# EAGLE schematic TrinTheremin (EAGLE 8.2.0)
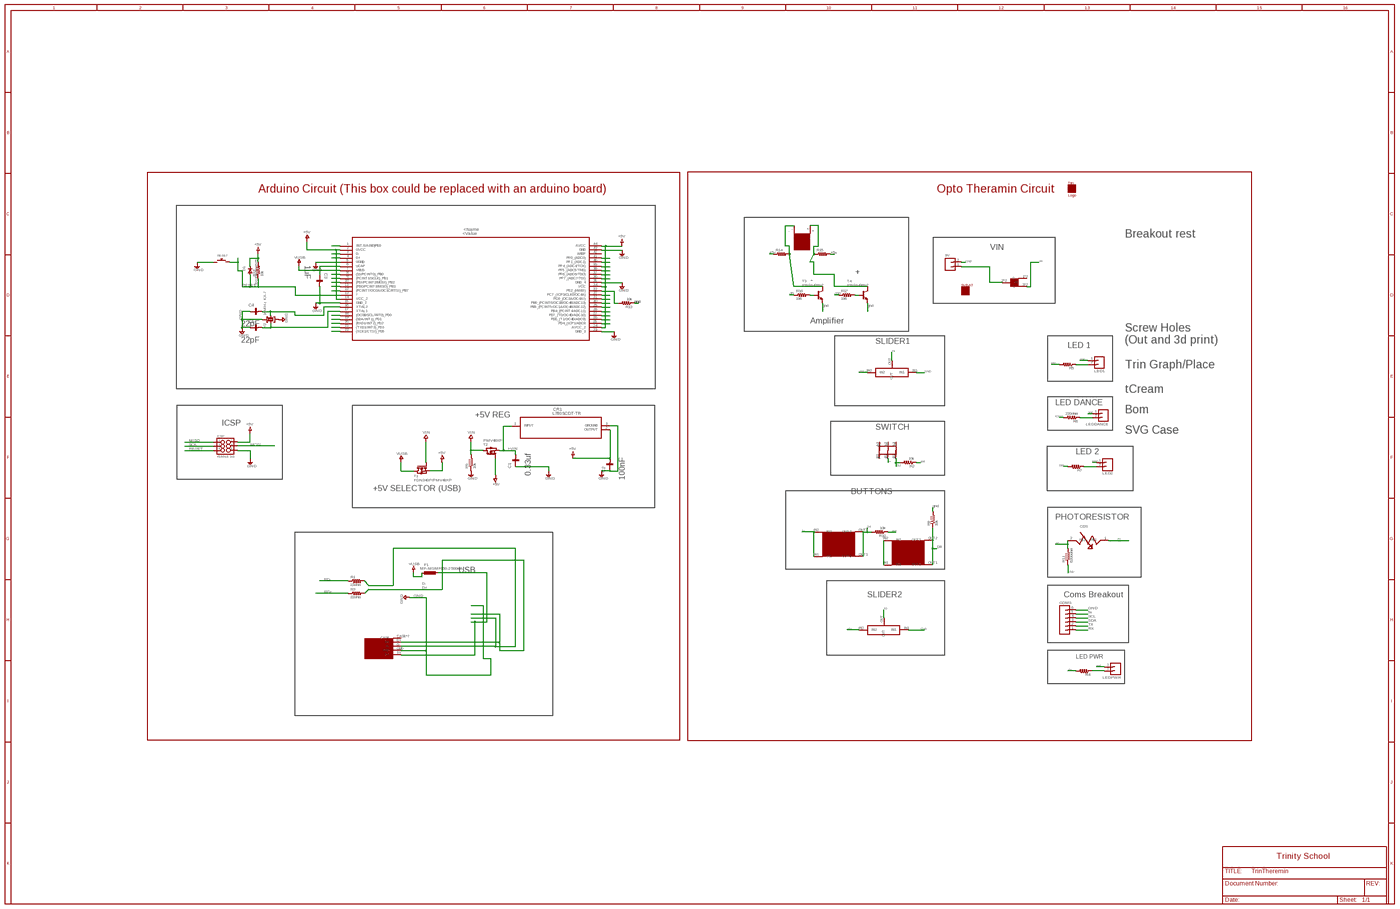
[diagram p0: schematic, sheet 1, overview]
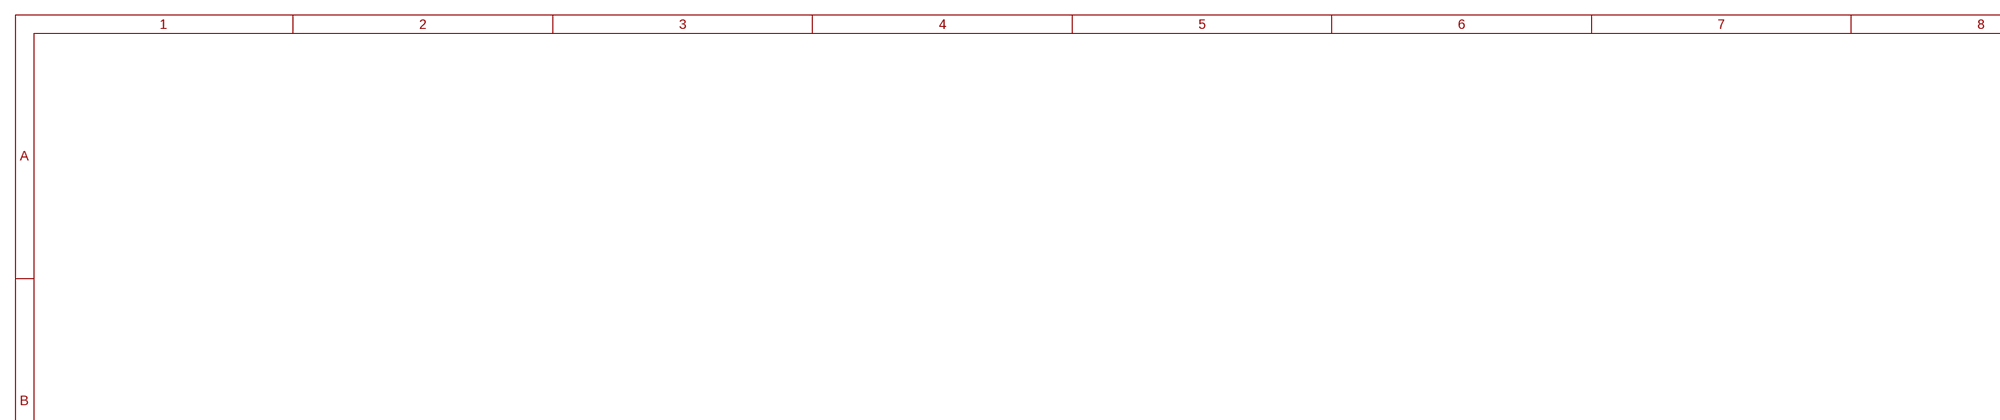
[diagram p1: schematic, sheet 1, part 1 of 4]
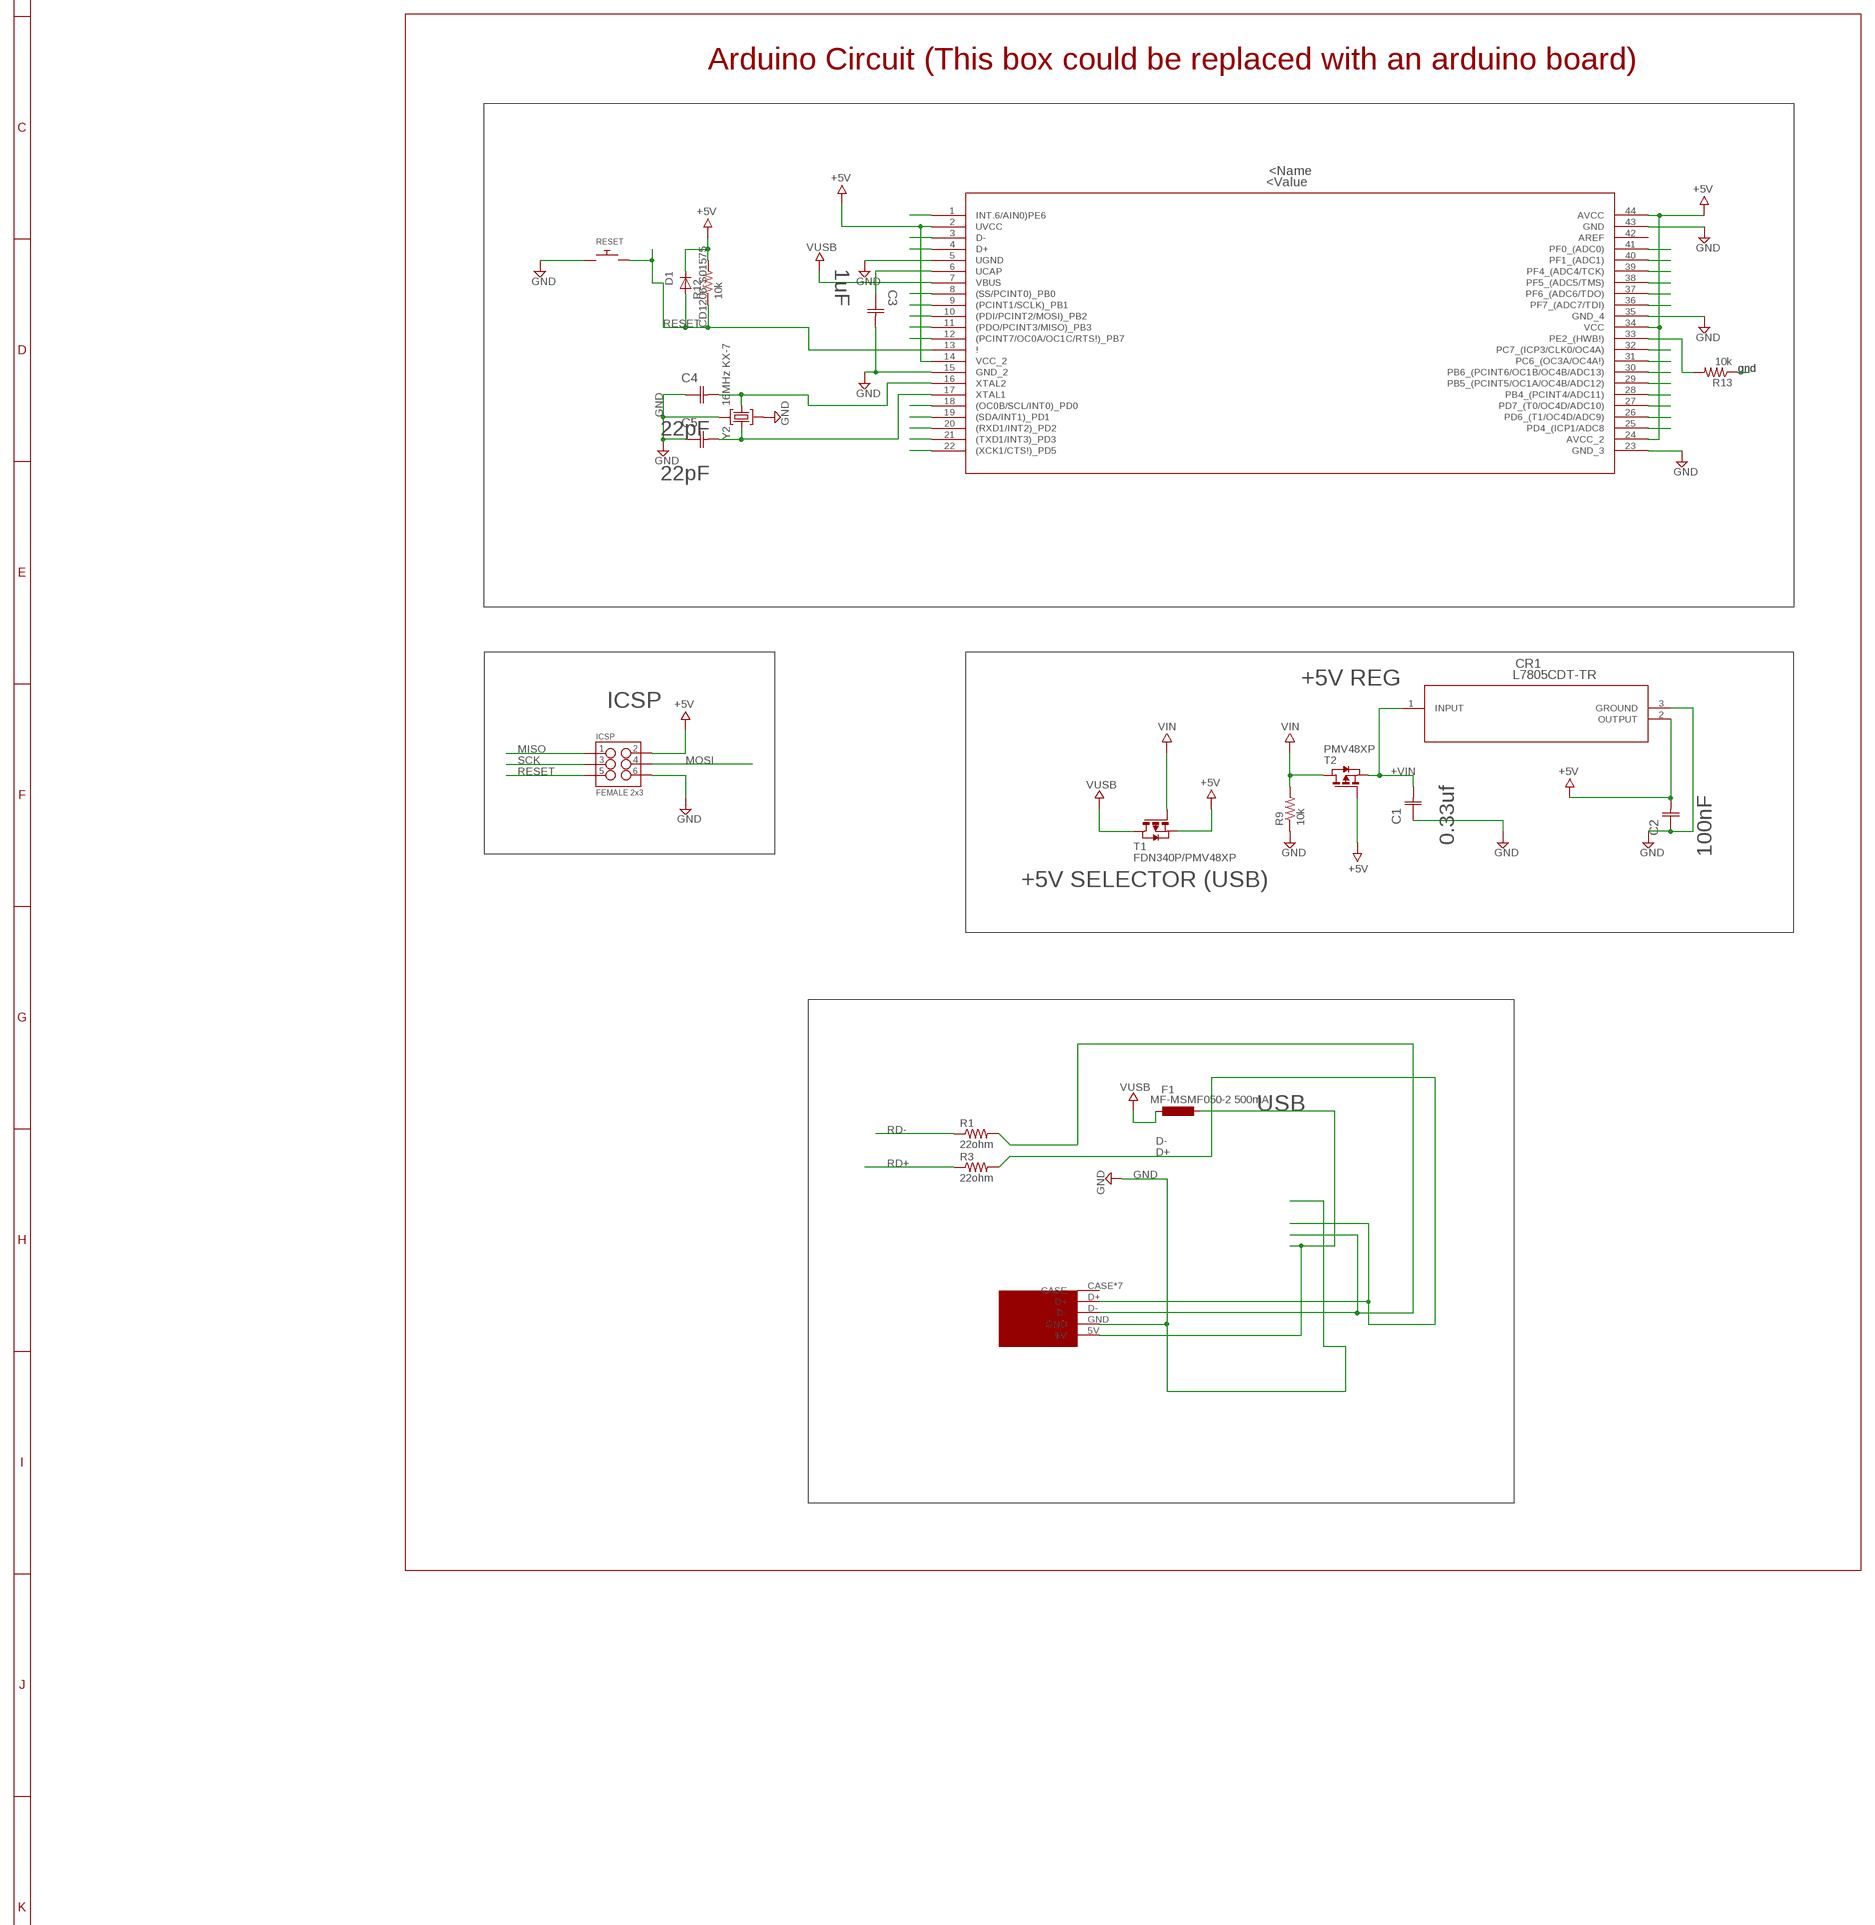
[diagram p2: schematic, sheet 1, part 2 of 4]
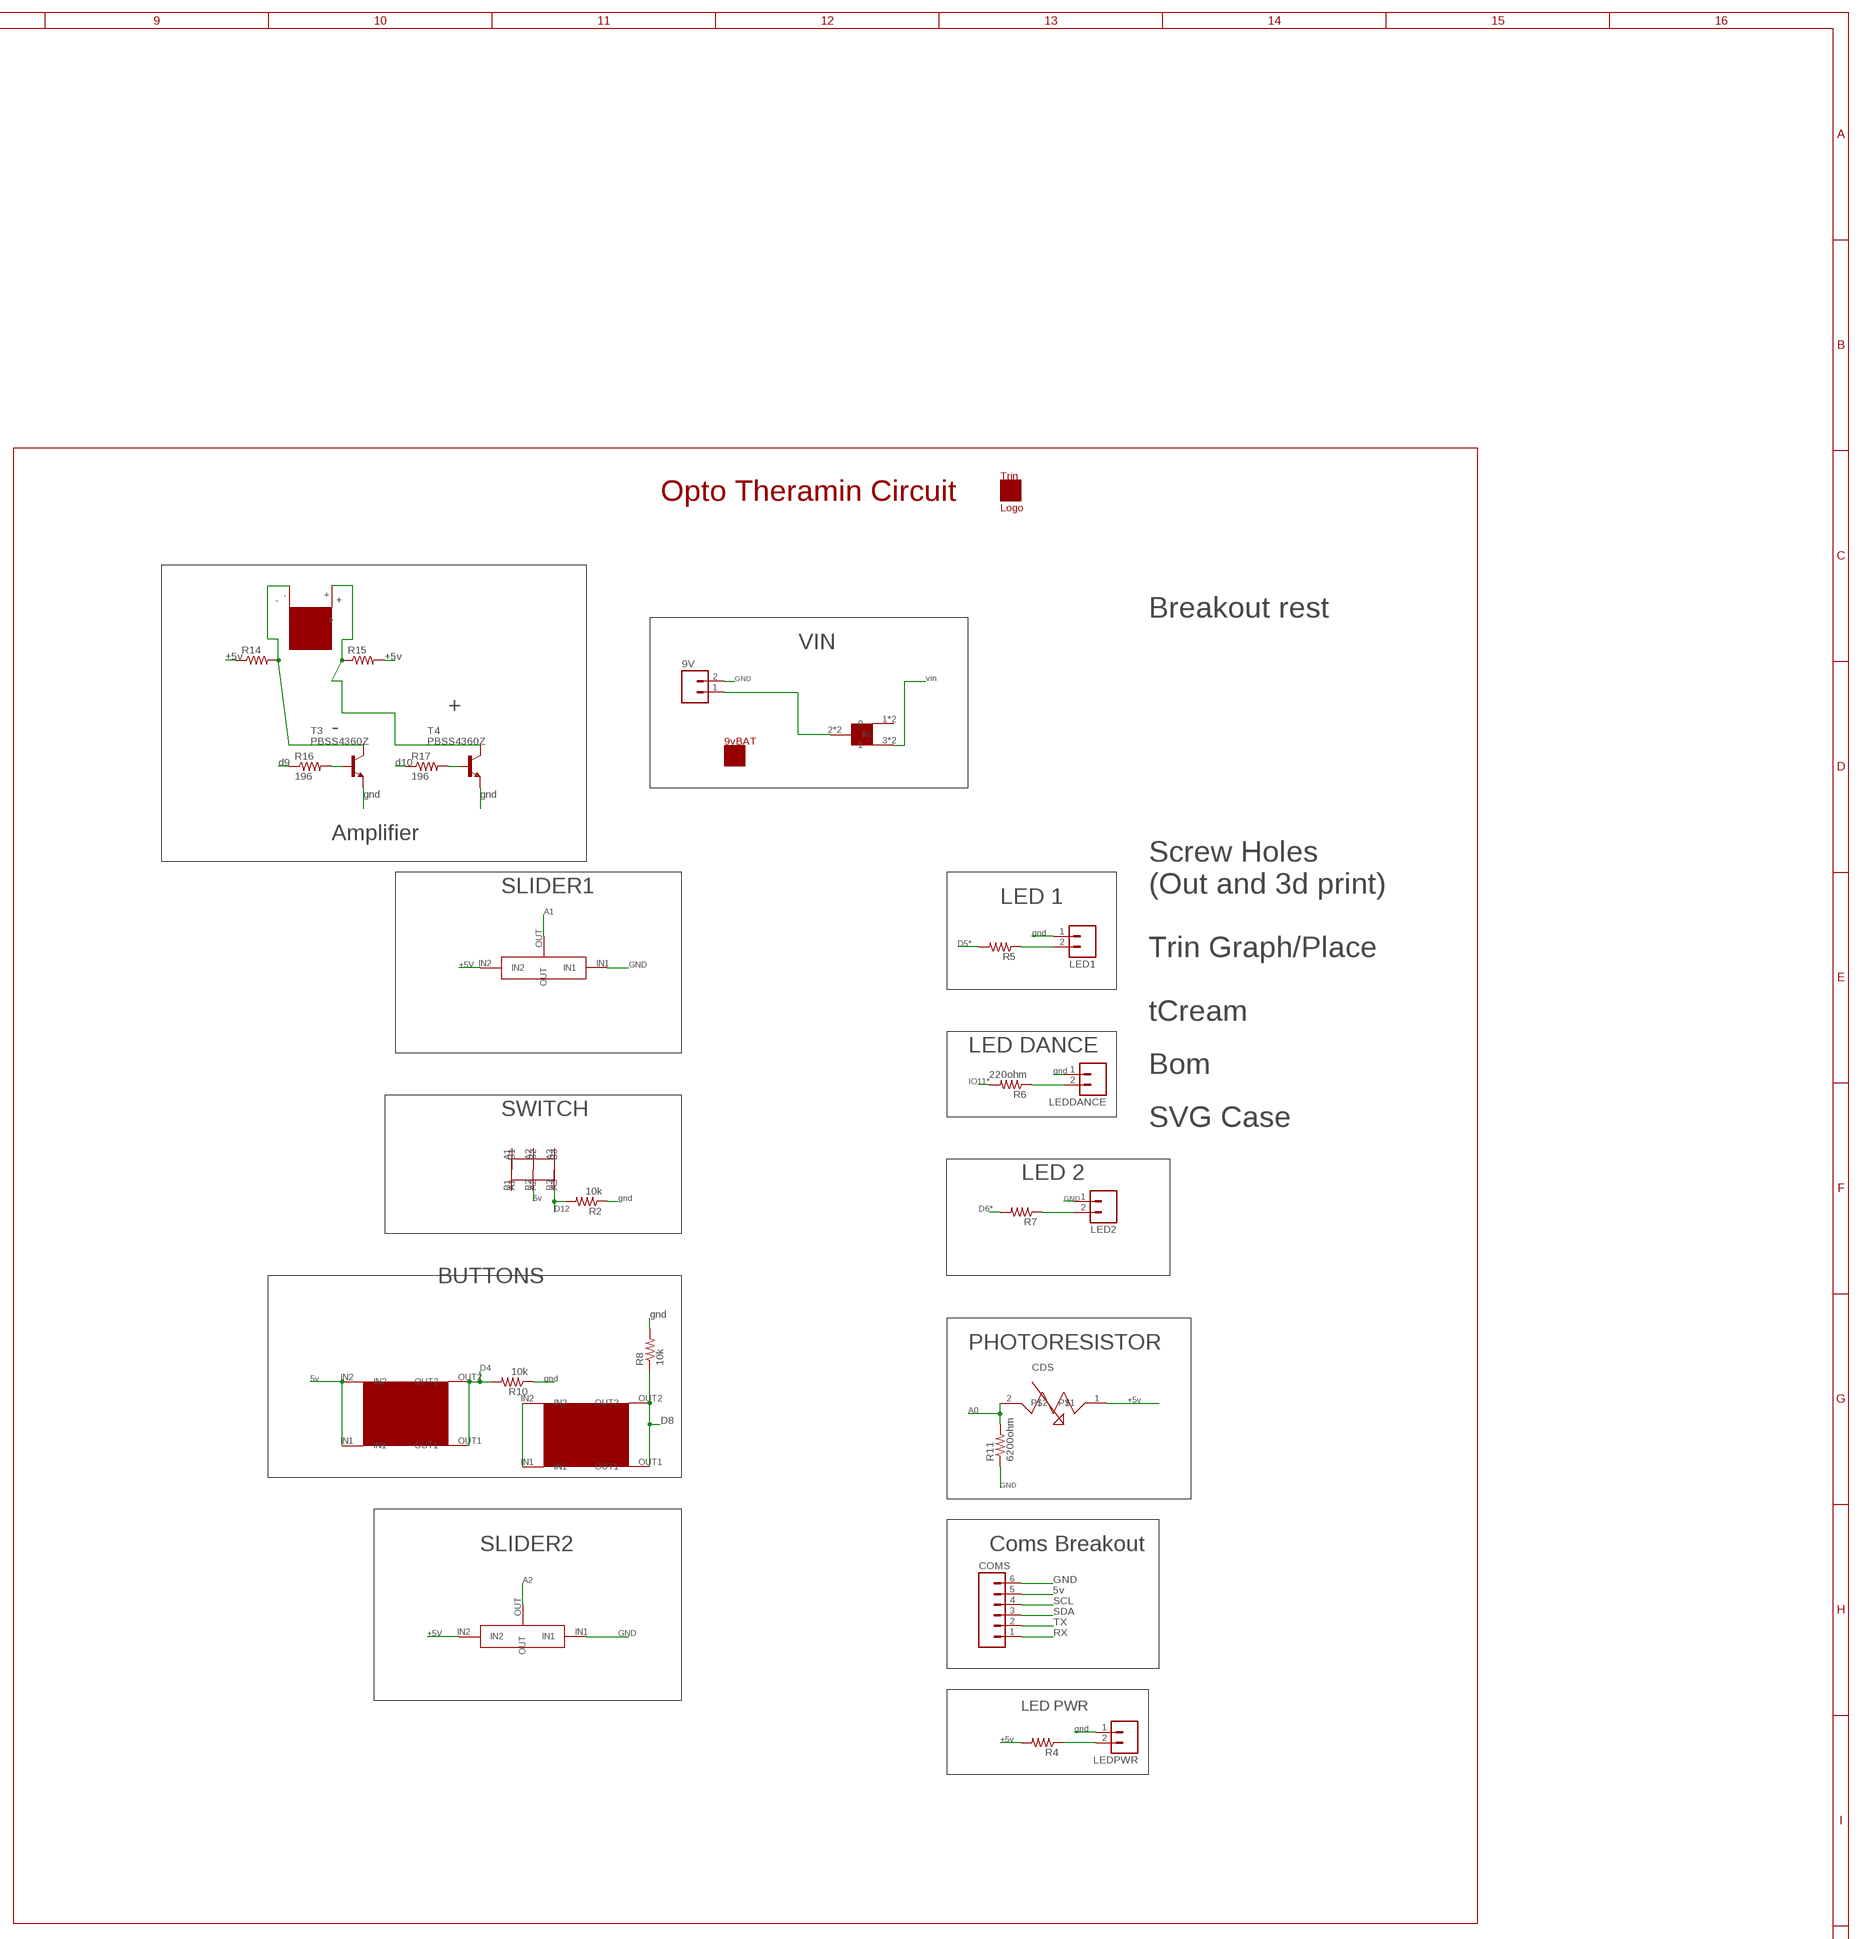
[diagram p3: schematic, sheet 1, part 3 of 4]
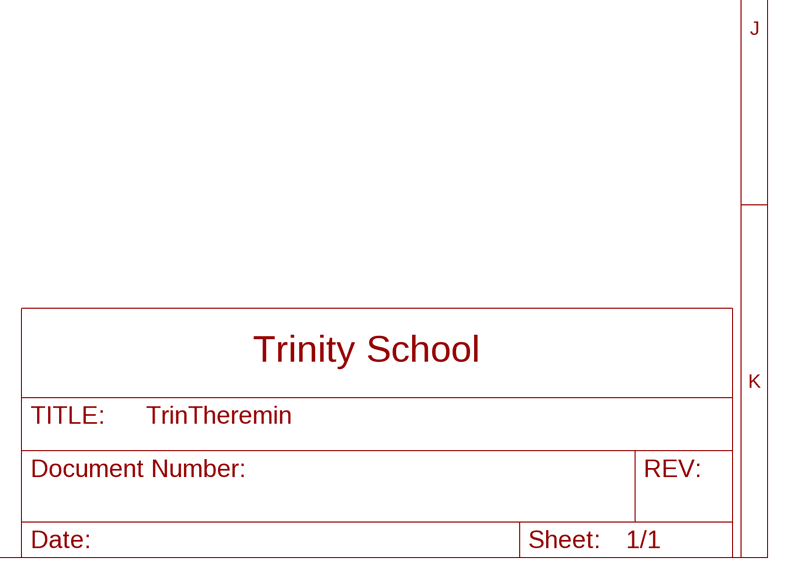
[diagram p4: schematic, sheet 1, part 4 of 4]

## Parts
9V  M02PTH  [1X02]
C1  0.33uf  C0805C104J5RACTU  [CAPC2013X110N]
C2  100nF  C0805C104J5RACTU  [CAPC2013X110N]
C3  1uF  C0603C105K3PACTU  [CAPC1608X85N]
C4  22pF  C0603C220J5GACTU  [CAPC1608X85N]
C5  22pF  C0603C220J5GACTU  [CAPC1608X85N]
COMS  M06SILK_FEMALE_PTH  [1X06]
CR1  L7805CDT-TR  [DPAK]
D1  CD1206-S01575  DIODE-MINIMELF  [MINIMELF]
F1  MF-MSMF050-2 500mA  L-EUL1812  [L1812]
ICSP  FEMALE 2x3  M03X2FEMALE  [2X3]
LED1  M02PTH  [1X02]
LED2  M02PTH  [1X02]
LEDDANCE  M02PTH  [1X02]
LEDPWR  M02PTH  [1X02]
R1  22ohm  R-US_R0603  [R0603]
R2  10k  RESISTOR0603  [0603-RES]
R3  22ohm  R-US_R0603  [R0603]
R4  RESISTOR0603  [0603-RES]
R5  RESISTOR0603  [0603-RES]
R6  220ohm  RESISTOR0603  [0603-RES]
R7  RESISTOR0603  [0603-RES]
R8  10k  RESISTOR0603  [0603-RES]
R9  10k  RESISTOR0603  [0603-RES]
R10  10k  RESISTOR0603  [0603-RES]
R11  6200ohm  RESISTOR0603  [0603-RES]
R12  10k  RESISTOR0603  [0603-RES]
R13  10k  RESISTOR0603  [0603-RES]
R14  R-US_R2512  [R2512]
R15  R-US_R2512  [R2512]
R16  196  RESISTOR1206  [1206]
R17  196  RESISTOR1206  [1206]
RESET  SWITCH_PUSHBUTTONC&K_KSS  [BTN_CK_KSS]
T1  FDN340P/PMV48XP  PMOSSOT23  [SOT-23]
T2  PMV48XP  PMOSSOT23  [SOT-23]
T3  PBSS4360Z  [SOT223]
T4  PBSS4360Z  [SOT223]
U$3  ATMEGA32U4-AU  [44ML]
U$8  PWRSWITCHTHRU  [PWRSWITCHTHRU]
U$9  CDS  [CDS]
U$10  DIGISLIDER  [DIGISLIDER]
U$11  DIGISWITCH  [DIGISWITCH]
U$13  BUT97  [BUT97]
U$14  DIGISLIDER  [DIGISLIDER]
U$15  9VBATHOLDERTALL  [9VBATHOLDERTALL]
U$16  TRIN  [TRIN]
U$17  BUT97  [BUT97]
U$20  GOODSPEAKER  [GOODSPEAKER]
U$23  MICROUSB  [MICROUSB]
Y2  16MHz KX-7  CRYSTAL-3.2-2.5  [CRYSTAL-3.2-2.5]

## Nets
+5V: C2.2(C2) COMS.5 CR1.2(OUTPUT) D1.C ICSP.2 R4.2 R12.2 R14.1 R15.2 T1.2(S) T2.3(G) U$3.2(UVCC) U$3.14(VCC_2) U$3.24(AVCC_2) U$3.34(VCC) U$3.44(AVCC) U$9.1 U$10.IN2 U$11.B2 U$13.IN1 U$13.IN2 U$14.IN2 U$17.IN1 U$17.IN2
+VIN: C1.2(C2) CR1.1(INPUT) T2.2(S)
A0: R11.2 U$3.36(PF7_(ADC7/TDI)) U$9.2
A1: U$3.37(PF6_(ADC6/TDO)) U$10.OUT
A2: U$3.38(PF5_(ADC5/TMS)) U$14.OUT
A3: U$3.39(PF4_(ADC4/TCK))
A4: U$3.40(PF1_(ADC1))
A5: U$3.41(PF0_(ADC0))
BASE: R16.2 T3.1(B)
COL: R14.2 T3.2(C) T3.4(C) U$20.-
D0/RX: COMS.1 U$3.20((RXD1/INT2)_PD2)
D1/TX: COMS.2 U$3.21((TXD1/INT3)_PD3)
D2/SDA: COMS.3 U$3.19((SDA/INT1)_PD1)
D3/SCL: COMS.4 U$3.18((OC0B/SCL/INT0)_PD0)
D4*: R10.2 U$3.25(PD4_(ICP1/ADC8) U$13.OUT1 U$13.OUT2
D5*: R5.2 U$3.31(PC6_(OC3A/OC4A!))
D6*: R7.2 U$3.27(PD7_(T0/OC4D/ADC10))
D7: U$3.1(INT.6/AIN0)PE6)
D+: R3.2 U$23.D+
D-: R1.2 U$23.D-
GND: 9V.2 C1.1(C1) C2.1(C1) C3.2(C2) C4.1(C1) C5.1(C1) COMS.6 CR1.3(GROUND) ICSP.6 LED1.1 LED2.1 LEDDANCE.1 LEDPWR.1 R2.1 R8.2 R9.1 R10.1 R11.1 R13.1 RESET.P$1 T3.3(E) T4.3(E) U$3.5(UGND) U$3.15(GND_2) U$3.23(GND_3) U$3.35(GND_4) U$3.43(GND) U$10.IN1 U$14.IN1 U$23.GND Y2.2(GND) Y2.4(GND)
HWB: R13.2 U$3.33(PE2_(HWB!))
IO8: R8.1 U$3.28(PB4_(PCINT4/ADC11)) U$17.OUT1 U$17.OUT2
IO9*: R16.1 U$3.29(PB5_(PCINT5/OC1A/OC4B/ADC12))
IO10*: R17.1 U$3.30(PB6_(PCINT6/OC1B/OC4B/ADC13))
IO11*: R6.2 U$3.12((PCINT7/OC0A/OC1C/RTS!)_PB7)
IO12*: R2.2 U$3.26(PD6_(T1/OC4D/ADC9)) U$11.B3
IO13*: U$3.32(PC7_(ICP3/CLK0/OC4A))
MISO: ICSP.1 U$3.11((PDO/PCINT3/MISO)_PB3)
MOSI: ICSP.4 U$3.10((PDI/PCINT2/MOSI)_PB2)
N$1: LED1.2 R5.1
N$2: R17.2 T4.1(B)
N$3: C3.1(C1) U$3.6(UCAP)
N$5: R15.1 T4.2(C) T4.4(C) U$20.+
N$6: LEDDANCE.2 R6.1
N$9: LED2.2 R7.1
N$10: 9V.1 U$8.2(IN) U$8.5(IN)
N$16: LEDPWR.2 R4.1
RAWUSB: F1.1 U$23.5V
RD+: R3.1 U$3.4(D+)
RD-: R1.1 U$3.3(D-)
RESET: D1.A ICSP.5 R12.1 RESET.P$2 U$3.13(!)
RXLED/SS: U$3.8((SS/PCINT0)_PB0)
SCK: ICSP.3 U$3.9((PCINT1/SCLK)_PB1)
TXLED: U$3.22((XCK1/CTS!)_PD5)
VIN: R9.2 T1.3(G) T2.1(D) U$8.3 U$8.6
VUSB: F1.2 T1.1(D) U$3.7(VBUS)
XTAL3: C4.2(C2) U$3.16(XTAL2) Y2.1(C1)
XTAL4: C5.2(C2) U$3.17(XTAL1) Y2.3(C2)
Unconnected: U$3.42(AREF) U$8.1 U$8.4 U$11.A1 U$11.A2 U$11.A3 U$11.B1 U$23.CASE U$23.CASE2(CASE) U$23.CASE3(CASE) U$23.CASE4(CASE) U$23.CASE5(CASE) U$23.CASE6(CASE) U$23.CASE7(CASE)

## Notes on the sheet
- Arduino Circuit (This box could be replaced with an arduino board) | Opto Theramin Circuit
- Breakout rest
- VIN
- +5v | +5v
- GND | vin
- +
- -
- d9 | d10
- gnd | gnd
- gnd | gnd
- Amplifier
- SLIDER1
- Screw Holes 
  (Out and 3d print)
- LED 1
- A1
- gnd
- D5*
- Trin Graph/Place
- +5V | GND
- tCream
- LED DANCE
- gnd | Bom
- +5V REG | IO11*
- ICSP
- SWITCH
- SVG Case
- LED 2
- 5v | gnd | GND
- D12 | D6*
- +5V SELECTOR (USB)
- BUTTONS
- gnd
- PHOTORESISTOR
- D4 | CDS
- 5v | gnd
- +5v
- A0
- D8
- USB | GND
- SLIDER2 | Coms Breakout
- A2 | GND
- 5v
- SCL
- SDA
- TX
- +5V | GND | RX
- LED PWR
- gnd
- +5v
- Trinity School

## Library data of the parts
9V LED1 LED2 LEDDANCE LEDPWR = SparkFun-Connectors:M02: Standard 2-pin 0.1" header. Use with - straight break away headers ( PRT-00116) - right angle break away headers (PRT-00553) - swiss pins (PRT-00743) - machine pins (PRT-00117) - female headers (PRT-00115) Molex polarized connector foot print use with: PRT-08233 with associated crimp pins and housings. 2.54_SCREWTERM for use with PRT-10571. 3.5mm Screw Terminal footprints for PRT-08084 5mm Screw Terminal footprints for use with PRT-08432
C1 = Kemet_By_element14_Batch_1:C0805C104J5RACTU: CAPACITOR, 0805; MPN: C0805C104J5RACTU; OC_FARNELL: 1414663; OC_NEWARK: 64K2889; SUPPLIER: Kemet; TOLERANCE: ±5%; VALUE: 100nF; VOLTAGERATING: 50V
C2 = Kemet_By_element14_Batch_1:C0805C104J5RACTU: CAPACITOR, 0805; MPN: C0805C104J5RACTU; OC_FARNELL: 1414663; OC_NEWARK: 64K2889; SUPPLIER: Kemet; TOLERANCE: ±5%; VOLTAGERATING: 50V
C3 = Kemet_By_element14_Batch_1:C0603C105K3PACTU: CAPACITOR, 0603; MPN: C0603C105K3PACTU; OC_FARNELL: 1288202; OC_NEWARK: 93K5996; SUPPLIER: Kemet; TOLERANCE: ±10%; VOLTAGERATING: 25V
C4 C5 = Kemet_By_element14_Batch_1:C0603C220J5GACTU: CAPACITOR, 0603; MPN: C0603C220J5GACTU; OC_FARNELL: 1414622; OC_NEWARK: 64K2846; SUPPLIER: Kemet; TOLERANCE: ±5%; VOLTAGERATING: 50V
COMS = SparkFun-Connectors:M06: Header 6 Standard 6-pin 0.1" header. Use with straight break away headers (SKU : PRT-00116), right angle break away headers (PRT-00553), swiss pins (PRT-00743), machine pins (PRT-00117), and female headers (PRT-00115). Molex polarized connector foot print use with SKU : PRT-08094 with associated crimp pins and housings. NOTES ON THE VARIANTS LOCK and LOCK_LONGPADS... This footprint was designed to help hold the alignment of a through-hole component (i.e. 6-pin header) while soldering it into place. You may notice that each hole has been shifted either up or down by 0.005 of an inch from it's more standard position (which is a perfectly straight line). This slight alteration caused the pins (the squares in the middle) to touch the edges of the holes. Because they are alternating, it causes a "brace" to hold the component in place. 0.005 has proven to be the perfect amount of "off-center" position when using our standard breakaway headers. Although looks a little odd when you look at the bare footprint, once you have a header in there, the alteration is very hard to notice. Also,if you push a header all the way into place, it is covered up entirely on the bottom side. This idea of altering the position of holes to aid alignment will be further integrated into the Sparkfun Library for other footprints. It can help hold any component with 3 or more connection pins.; PROD_ID: CONN-08437
CR1 = Dpak:L7805CDT-TR; MANUFACTURER_PART_NUMBER: L7805CDTTR; VENDOR: ST Microelectronics
D1 = diode:DIODE-: DIODE
F1 = rcl:L-EU: INDUCTOR, European symbol
ICSP = SparkFun-Connectors:M03X2: 2x3 .1" header. Shrouded, with keying- CONN-10681 SMT- CONN-11415 Pogo pins- HW-11044; PROD_ID: CONN-11566
R1 R3 R14 R15 = adafruit:R-US_: RESISTOR, American symbol
R2 R4-R13 R16 R17 = SparkFun-Resistors:RESISTOR: Resistor Basic schematic elements and footprints for 0603, 1206, and PTH resistors.
RESET = adafruit:SWITCH_PUSHBUTTON: Buttons SOFTTOUCHSMD_SJ - Soft touch temporary push button (Super Junk Akihabara) Compatible with SKPMANE010 [Mouser: 688-SKPMAN] C&K_KSS = Digikey: KSS221GLFS
T1 T2 = zetex:PMOSSOT23: MOS FET
T3 T4 = NXP_60_26022015:PBSS4360Z: 60 V, 3 A NPN low VCEsat (BISS) transistor NPN low VCEsat Breakthrough In Small Signal (BISS) transistor in a medium power SOT223 (SC-73) Surface-Mounted Device (SMD) plastic package. PNP complement: PBSS5360Z. AAL Eindhoven MK
U$3 = 32u4:ATMEGA32U4-AU; COPYRIGHT: Copyright C 2015 Accelerated Designs. All rights reserved; MANUFACTURER_PART_NUMBER: ATMEGA32U4AU; VENDOR: Atmel
U$8 = OptoTher:PWRSWITCHTHRU
U$9 = OptoTher:CDS
U$10 U$14 = OptoTher:DIGISLIDER
U$11 = OptoTher:DIGISWITCH
U$13 U$17 = OptoTher:BUT97
U$15 = OptoTher:9VBATHOLDERTALL
U$16 = OptoTher:TRIN
U$20 = OptoTher:GOODSPEAKER
U$23 = OptoTher:MICROUSB
Y2 = SmartPrj:CRYSTAL-3.2-2.5